# Altium schematic sheet Level Shifter.SchDoc
size A; SheetNumber: 1; SheetTotal: 1
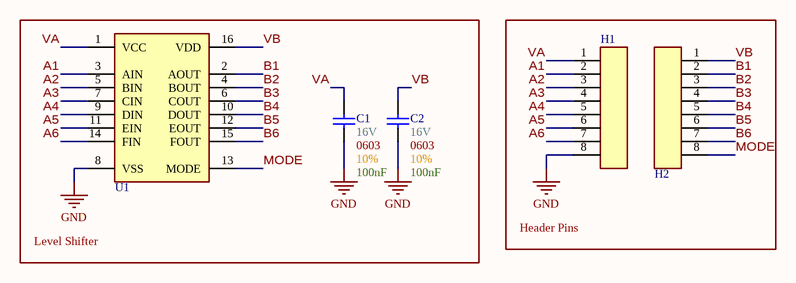
[diagram p0: Level Shifter.SchDoc]

## Parts
C1  Max Voltage: 16V  Size Package: 0603  Tolerance: 10%  Capacitance: 100nF  [[Cap] SMD 0603]  (hidden comment: [Cap] 0603 0.1uF 10% 16V)
C2  Max Voltage: 16V  Size Package: 0603  Tolerance: 10%  Capacitance: 100nF  [[Cap] SMD 0603]  (hidden comment: [Cap] 0603 0.1uF 10% 16V)
H1  1x8 Header  [[Header] 1x8 Male]  (value not drawn)
H2  1x8 Header  [[Header] 1x8 Male]  (value not drawn)
U1  [Level Shifter] 3-18V Unidirectional  [[Level Shifter] 3-18V Unidirectional]  (value not drawn)

## Blocks framed on the sheet
Level Shifter: C1 C2 U1
Header Pins: H1 H2

## Nets
GND: C1.1 C2.1 H1.8 U1.8(VSS)
A1: H1.2 U1.3(AIN)
A2: H1.3 U1.5(BIN)
A3: H1.4 U1.7(CIN)
A4: H1.5 U1.9(DIN)
A5: H1.6 U1.11(EIN)
A6: H1.7 U1.14(FIN)
B1: H2.2 U1.2(AOUT)
B2: H2.3 U1.4(BOUT)
B3: H2.4 U1.6(COUT)
B4: H2.5 U1.10(DOUT)
B5: H2.6 U1.12(EOUT)
B6: H2.7 U1.15(FOUT)
MODE: H2.8 U1.13(MODE)
VA: C1.2 H1.1 U1.1(VCC)
VB: C2.2 H2.1 U1.16(VDD)

## Library data of the parts
C1 C2 = [Cap] 0603 0.1uF 10% 16V: CC0603KRX7R7BB104; Supplier 1: DigiKey; Supplier Part Number 1: 311-1088-6-ND
H1 H2 = [Header] 1x8 Male: 2.54mm pitch
U1 = [Level Shifter] 3-18V Unidirectional: MC14504BDTR2G; Supplier 1: DigiKey; Supplier Part Number 1: MC14504BDTR2GOSCT-ND